# Altium schematic sheet SDEC944-xD_Fil_Pilote_1-2_(commun).SchDoc: Fil Pilote (1/2)
size 393 x 270 mm; CompanyName: Seccom; Address1: 521, rue du capt. François Garbit; Address2: 69440 Mornant; Address3: seccom@seccom.fr; Address4: www.seccom.fr; DocumentNumber: 14; SheetNumber: 14; SheetTotal: 22; PageSetup: Record=PageOptions|CenterHorizontal=True|CenterVertical=True|PrintScale=0.72|XCorrection=1.00|YCorrection=1.00|PrintKind=0|BorderSize=5000000|LeftOffset=0|BottomOffset=0|Orientation=2|PaperLength=1000|PaperWidth=1000|Scale=100|PaperSource=7|PrintQuality=-4|MediaType=1|DitherType=10|PaperKind=A4|PrintScaleMode=1
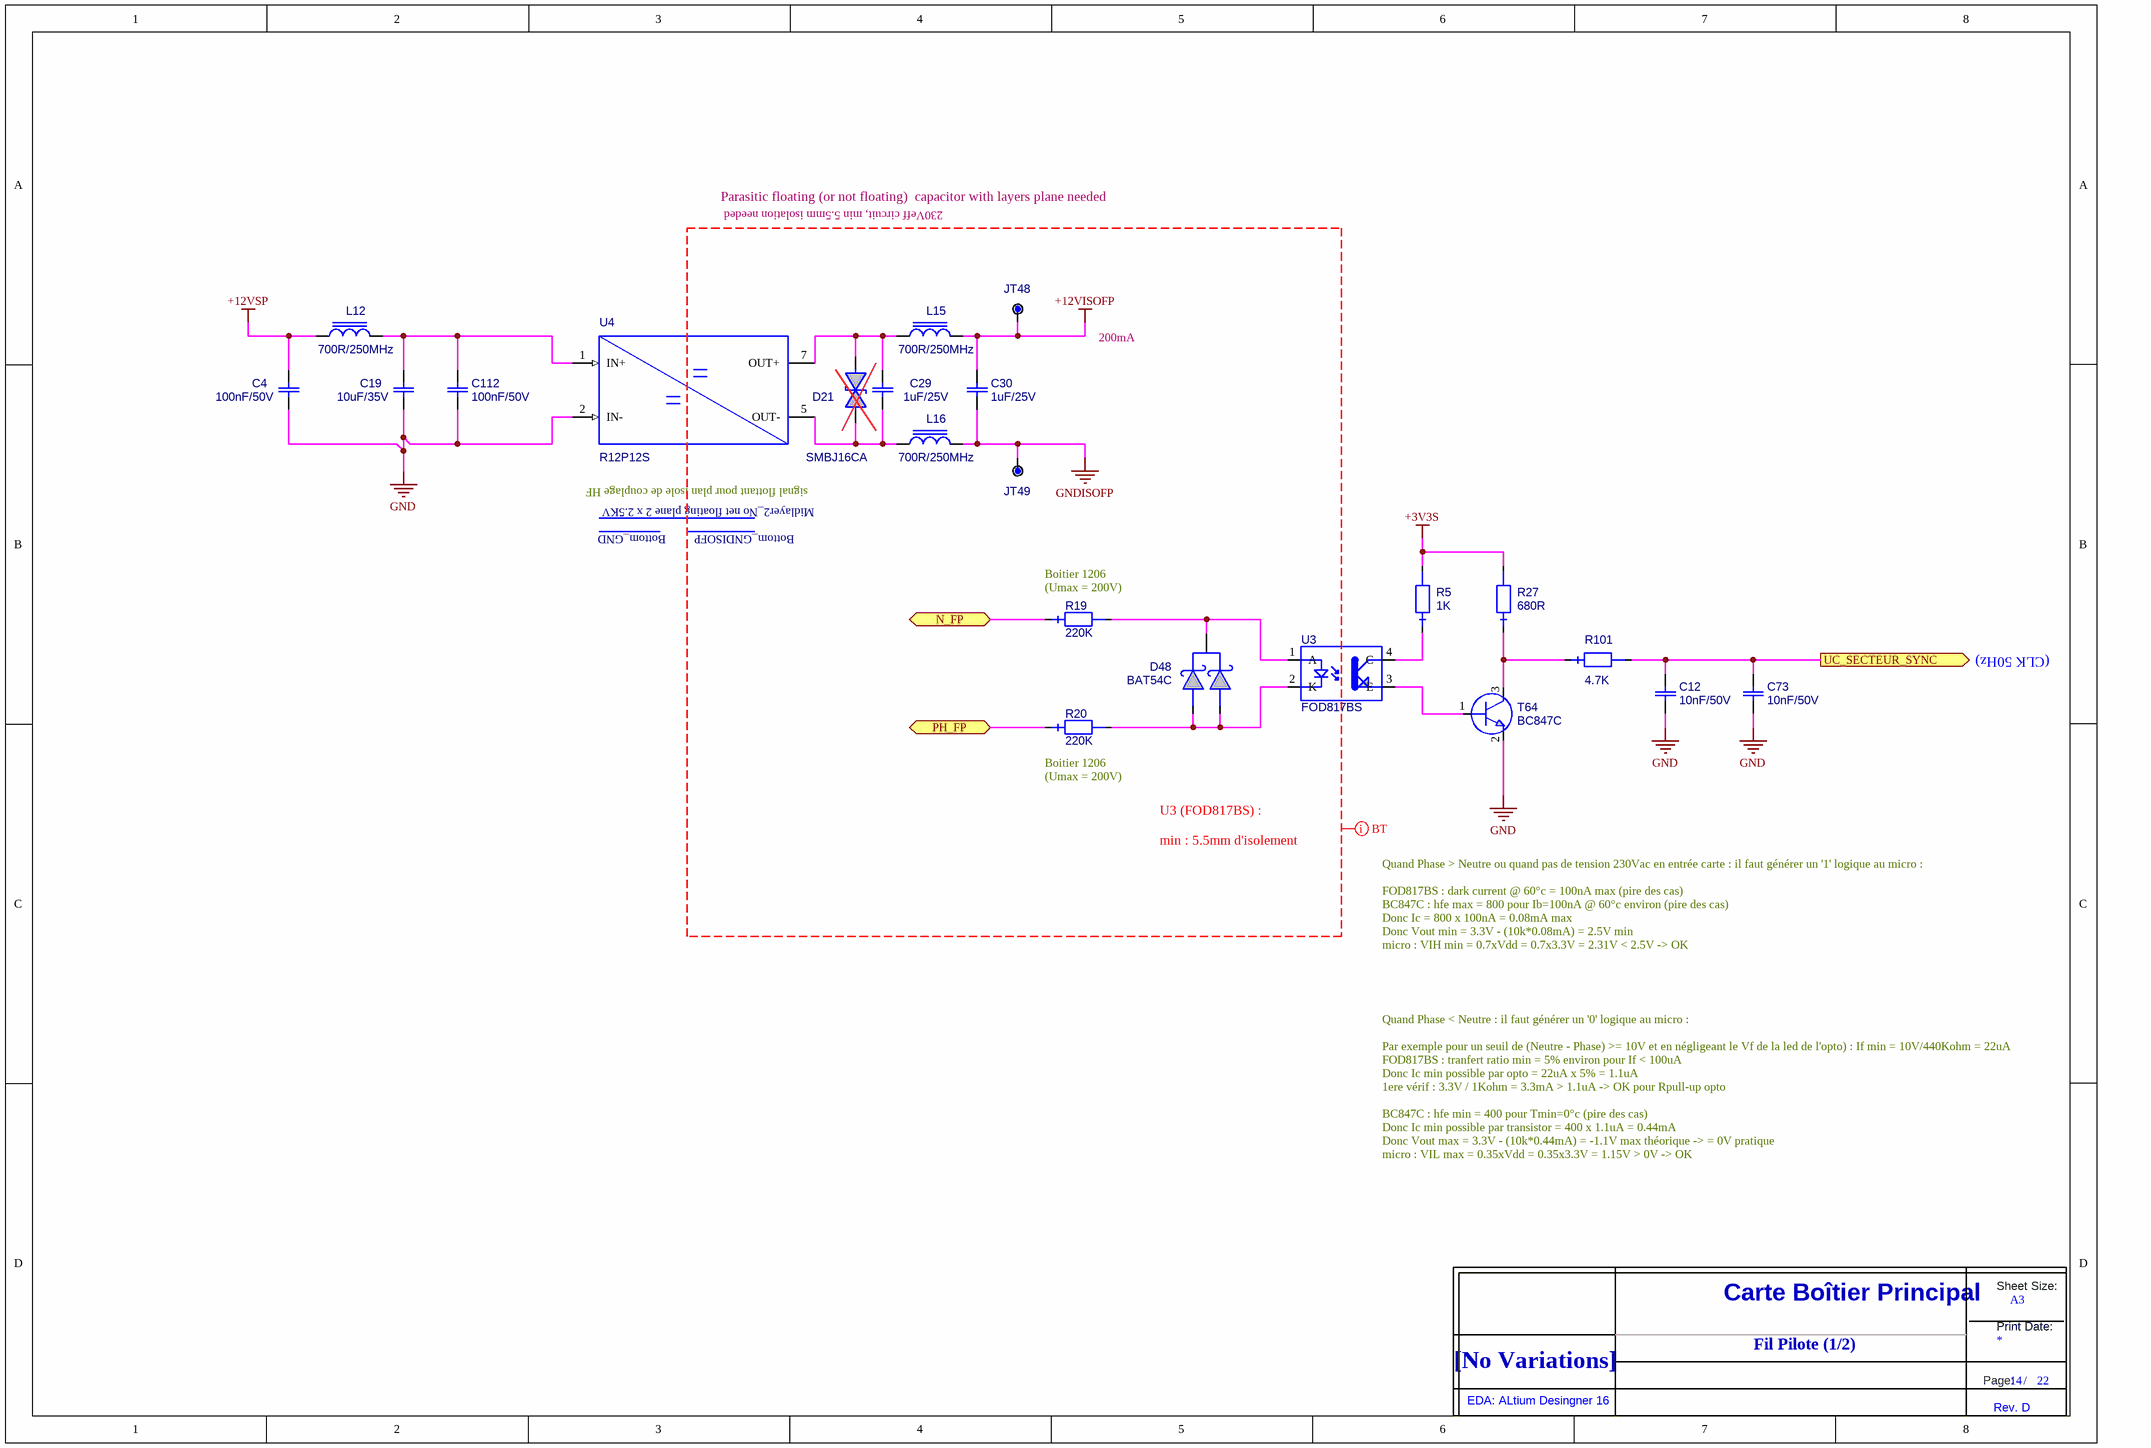
[diagram p0: SDEC944-xD_Fil_Pilote_1-2_(commun).SchDoc]

## Parts
C4  value 100nF/50V  [0603_ReflowSoldering_CAP]  (hidden comment: C_0603_X7R_10%_100N-50V)
C12  value 10nF/50V  [0603_ReflowSoldering_CAP]  (hidden comment: C_0603_X7R_10%_10N-50V)
C19  value 10uF/35V  [1210_ReflowSoldering_CAP]  (hidden comment: C_1210_X5R_10%_10U-35V)
C29  value 1uF/25V  [0805_ReflowSoldering_CAP]  (hidden comment: C_0805_X5R_10%_1U-25V)
C30  value 1uF/25V  [0805_ReflowSoldering_CAP]  (hidden comment: C_0805_X5R_10%_1U-25V)
C73  value 10nF/50V  [0603_ReflowSoldering_CAP]  (hidden comment: C_0603_X7R_10%_10N-50V)
C112  value 100nF/50V  [0603_ReflowSoldering_CAP]  (hidden comment: C_0603_X7R_10%_100N-50V)
D21  SMBJ16CA  [DO214AA-SMB-NP_ReflowSoldering]  (no BOM)
D48  BAT54C  [SOT23_3L_ReflowSoldering]
JT48  POINT_TEST_PAD_40MIL  [PAD_CL5_E40X40Y17D]  (value not drawn)  (no BOM)
JT49  POINT_TEST_PAD_40MIL  [PAD_CL5_E40X40Y17D]  (value not drawn)  (no BOM)
L12  value 700R/250MHz  [0603_ReflowSoldering_CAP]  (hidden comment: IND_FERRITE_0603_742792643)
L15  value 700R/250MHz  [0603_ReflowSoldering_CAP]  (hidden comment: IND_FERRITE_0603_742792643)
L16  value 700R/250MHz  [0603_ReflowSoldering_CAP]  (hidden comment: IND_FERRITE_0603_742792643)
R5  value 1K  [0603_ReflowSoldering_RES]  (hidden comment: RES_0603_1%_100PPM_1K)
R19  value 220K  [1206_ReflowSoldering_RES]  (hidden comment: RES_1206_1%_100PPM_220K)
R20  value 220K  [1206_ReflowSoldering_RES]  (hidden comment: RES_1206_1%_100PPM_220K)
R27  value 680R  [0603_ReflowSoldering_RES]  (hidden comment: RES_0603_1%_100PPM_680R)
R101  value 4.7K  [0603_ReflowSoldering_RES]  (hidden comment: RES_0603_1%_100PPM_4.7K)
T64  BC847C  [SOT23_3L_ReflowSoldering]
Title_new  DNI  (value not drawn)  (graphical)
U3  value FOD817BS  [OPTO_FOD817BS_ReflowSoldering]  (hidden comment: OPTO_FOD817BS)
U4  value R12P12S  [DCDC_SIP_1W_19.5x9.8_h12.5_R12P12S]  (hidden comment: DCDC_+12V_1W_R12P12S)

## Ports
N_FP, PH_FP, UC_SECTEUR_SYNC (out)

## Nets
+3V3S: R5.2 R27.2
+12VISOFP: C30.2 JT48.1 L15.2
+12VSP: C4.1 L12.1
GND: C4.2 C12.1 C19.1 C73.1 C112.2 T64.2(E) U4.2(IN-)
GNDISOFP: C30.1 JT49.1 L16.2
N_FP: R19.1 ; port N_FP
PH_FP: R20.1 ; port PH_FP
UC_SECTEUR_SYNC: C12.2 C73.2 R101.2 ; port UC_SECTEUR_SYNC
NetC19_2: C19.2 C112.1 L12.2 U4.1(IN+)
NetC29_1: C29.1 D21.2 L16.1 U4.5(OUT-)
NetC29_2: C29.2 D21.1 L15.1 U4.7(OUT+)
NetD48_1: D48.1 D48.2 R20.2 U3.2(K)
NetD48_3: D48.3 R19.2 U3.1(A)
NetR5_1: R5.1 U3.4(C)
NetR27_1: R27.1 R101.1 T64.3(C)
NetT64_1: T64.1(B) U3.3(E)

## Layout directives
net class BT: +12VISOFP, GNDISOFP

## Notes on the sheet
- Parasitic floating (or not floating)  capacitor with layers plane needed
- 230Veff circuit, min 5.5mm isolation needed
- 200mA
- Bottom_GND
- Bottom_GNDISOFP
- signal flottant pour plan isole de couplage HF
- Midlayer2_No net floating plane 2 x 2.5KV
- (near R19) Boitier 1206
  (Umax = 200V)
- (CLK 50Hz)
- (near R20) Boitier 1206
  (Umax = 200V)
- U3 (FOD817BS) :
  min : 5.5mm d'isolement
- Quand Phase > Neutre ou quand pas de tension 230Vac en entrée carte : il faut générer un '1' logique au micro :
  FOD817BS : dark current @ 60°c = 100nA max (pire des cas)
  BC847C : hfe max = 800 pour Ib=100nA @ 60°c environ (pire des cas)
  Donc Ic = 800 x 100nA = 0.08mA max
  Donc Vout min = 3.3V - (10k*0.08mA) = 2.5V min
  micro : VIH min = 0.7xVdd = 0.7x3.3V = 2.31V < 2.5V -> OK
- Quand Phase < Neutre : il faut générer un '0' logique au micro :
  Par exemple pour un seuil de (Neutre - Phase) >= 10V et en négligeant le Vf de la led de l'opto) : If min = 10V/440Kohm = 22uA
  FOD817BS : tranfert ratio min = 5% environ pour If < 100uA
  Donc Ic min possible par opto = 22uA x 5% = 1.1uA
  1ere vérif : 3.3V / 1Kohm = 3.3mA > 1.1uA -> OK pour Rpull-up opto
  BC847C : hfe min = 400 pour Tmin=0°c (pire des cas)
  Donc Ic min possible par transistor = 400 x 1.1uA = 0.44mA
  Donc Vout max = 3.3V - (10k*0.44mA) = -1.1V max théorique -> = 0V pratique
  micro : VIL max = 0.35xVdd = 0.35x3.3V = 1.15V > 0V -> OK
- Fil Pilote (1/2)
- (in symbol Title_new) Sheet Size:; Carte Boîtier Principal; A3; Print Date:; [No Variations]; Page:; /; EDA: ALtium Desingner 16; Rev. D

## Library data of the parts
C4 C112 = C_0603_X7R_10%_100N-50V: Condensateur céramique, X7R, 10%, CMS 0603, 100nF/50V; Creation: FB (29/02/12); Boitier: 0603; Remarque: {Remarque}; Fabricant: Kemet; Ref Fab: C0603C104K5RAC; Coeff: 1; ComponentLink1URL: O:\_Documentation\Datasheets\Kemet\Condos_Ceramic_CMS.pdf; ComponentLink2URL: o:\_Documentation\Datasheets\_BOITIERS\PASSIF_CMS\; Config: *; ComponentLink1Description: Datasheet; ComponentLink2Description: Datasheet Boitier; Supplier 1: Farnell; Supplier Part Number 1: 1288255
C12 C73 = C_0603_X7R_10%_10N-50V: Condensateur céramique, X7R, 10%, CMS 0603; Creation: CHD; Boitier: 0603; Remarque: {Remarque}; Coeff: 1; Fabricant: Kemet; Ref Fab: C0603C103K5RAC; ComponentLink1URL: o:\_Documentation\Datasheets\Kemet\Condos_Ceramic_CMS.pdf; ComponentLink2URL: o:\_Documentation\Datasheets\_BOITIERS\PASSIF_CMS\; Config: *; ComponentLink1Description: Datasheet; ComponentLink2Description: Datasheet Boitier; Supplier 1: Farnell; Supplier Part Number 1: 1414609
C19 = C_1210_X5R_10%_10U-35V: Condensateur céramique, X5R, 10%, CMS 1210; Creation: LJ (09/02/09); Reference: 000265/00; Boitier: 1210; Remarque: {Remarque}; Coeff: 1; Fabricant: Taiyo Yuden; Ref Fab: GMK325BJ106KN-T; Verification: *; ComponentLink1URL: o:\_Documentation\Datasheets\TaiyoYuden\High_Value_Multilayer_Ceramic_Caps.pdf; ComponentLink2URL: o:\_Documentation\Datasheets\_Boitiers\PASSIF_CMS\C_1210_(3,2x2,5)_(Schneider).pdf; Config: *; ComponentLink1Description: Datasheet; ComponentLink2Description: Datasheet Boitier
C29 C30 = C_0805_X5R_10%_1U-25V: Condensateur céramique, X5R, 10%, CMS 0805; Creation: FB (07/03/12); Reference: 001834/00; Boitier: 0805; Remarque: {Remarque}; Coeff: 1; Fabricant: AVX; Ref Fab: 08053D105KAT2A; Verification: *; ComponentLink1URL: O:\_Documentation\Datasheets\AVX\Condensateurs_CMS_Ceramic_X5R.pdf; ComponentLink2URL: o:\_Documentation\Datasheets\_Boitiers\PASSIF_CMS\RC_0805_(2x1,25)_(Schneider).pdf; Config: *; ComponentLink1Description: Datasheet; ComponentLink2Description: Datasheet Boitier; Supplier Part Number 1: 1327695; Supplier Part Number 2: 6983409; Supplier 1: Farnell; Supplier 2: Radiospares
D21 = SMBJ16CA: Diode Transil/TVS bidirectionnelle (CA), 600W, 16V, CMS, serie SMBJ; Creation: FB (30/07/13); Boitier: DO214AA/SMB; Remarque: {Remarque}; Coeff: 1; Fabricant: Bourns; ComponentLink1URL: O:\_Documentation\Datasheets\Bourns\SMBJ_diodes_TVS_600W.pdf; ComponentLink2URL: o:\_Documentation\Datasheets\_BOITIERS\ACTIF_CMS\SMx\SMB_(Schneider).lnk; Config: *; ComponentLink1Description: Datasheet; ComponentLink2Description: Datasheet Boitier; Ref Fab: SMBJ16CA; Supplier Part Number 1: 652-SMBJ16CA; Supplier 1: Mouser; Value: SMBJ16CA
D48 = BAT54C: Diode Schottky double, BAT54 cathode com, Vrrm=30V, If=300mA, Vf=0.4Vmax, CMS; Creation: LJ (14/05/02); Reference: 000597/00; Boitier: SOT23_3L; Remarque: {Remarque}; Coeff: 1; Fabricant: NXP; Verification: LJ (14/05/02); ComponentLink1URL: O:\_Documentation\Datasheets\NXP\BAT54_series.pdf; ComponentLink2URL: o:\_Documentation\Datasheets\_BOITIERS\ACTIF_CMS\SOT\SOT_23_3P_(Schneider).PDF; Config: *; ComponentLink1Description: Datasheet; ComponentLink2Description: Datasheet Boitier; Ref Fab: BAT54C; Supplier 1: Farnell; Supplier Part Number 1: 1081192; Value: BAT54C
JT48 JT49 = POINT_TEST_PAD_40MIL: Point de test sur CI, pad de diamètre 1.016mm (40mils); Creation: FB (04/10/12); Remarque: {Remarque}; Coeff: 1; Value: POINT_TEST; Config: *; ComponentLink1Description: Datasheet; ComponentLink2Description: Datasheet Boitier
L12 L15 L16 = IND_FERRITE_0603_742792643: Inductance à ferrite multicouches CMS, imp=700R@250MHz, +/-25%, Rdc=350mR, I=400mA; Creation: PDP (02/08/12); Boitier: 0603; Coeff: 1; Fabricant: Wurth Elektronik; ComponentLink1URL: o:\_Documentation\Datasheets\Murata\Ferrite_BLM21P.pdf; Config: *; ComponentLink1Description: Datasheet; ComponentLink2Description: Datasheet Boitier; Ref Fab: 742792643; Supplier 1: Farnell; Supplier Part Number 1: 1800349
R5 = RES_0603_1%_100PPM_1K: Résistance, 0.100W, 1%, 100ppm, 75V, 1K; Creation: JPL (05/07/12); Boitier: 0603; Remarque: {Remarque}; Fabricant: Vishay; Ref Fab: CRCW06031K00FKEA; Coeff: 1; Verification: *; ComponentLink1URL: O:\_Documentation\Datasheets\Vishay\Resistances_D-CRCWe3.pdf; ComponentLink2URL: o:\_Documentation\Datasheets\_BOITIERS\PASSIF_CMS\; Config: *; ComponentLink1Description: Datasheet; ComponentLink2Description: Datasheet Boitier; Supplier 1: Farnell; Supplier 2: RadioSpares; Supplier Part Number 1: 1469740; Supplier Part Number 2: 6789875
R19 R20 = RES_1206_1%_100PPM_220K: Résistance, 0.25W, 1%, 100ppm, 200V, 220K; Creation: PDP (29/09/12); Boitier: 1206; Remarque: {Remarque}; Fabricant: Vishay; Ref Fab: CRCW1206220KFKEA; Coeff: 1; Verification: *; ComponentLink1URL: O:\_Documentation\Datasheets\Vishay\Resistances_D-CRCWe3.pdf; ComponentLink2URL: o:\_Documentation\Datasheets\_BOITIERS\PASSIF_CMS\; Config: *; ComponentLink1Description: Datasheet; ComponentLink2Description: Datasheet Boitier; Supplier 1: Mouser; Supplier Part Number 1: 71-CRCW1206-220K-E3; Supplier 2: Farnell; Supplier Part Number 2: 1152834
R27 = RES_0603_1%_100PPM_680R: Résistance, 0.100W, 1%, 100ppm, 75V, 680R; Creation: FB (02/08/12); Boitier: 0603; Remarque: {Remarque}; Fabricant: Vishay; Ref Fab: CRCW0603680RFKEA; Coeff: 1; Verification: *; ComponentLink1URL: O:\_Documentation\Datasheets\Vishay\Resistances_D-CRCWe3.pdf; ComponentLink2URL: o:\_Documentation\Datasheets\_BOITIERS\PASSIF_CMS\; Config: *; ComponentLink1Description: Datasheet; ComponentLink2Description: Datasheet Boitier; Supplier 1: Farnell; Supplier Part Number 1: 1469834; Supplier 2: Mouser; Supplier Part Number 2: 71-CRCW0603-680-E3
R101 = RES_0603_1%_100PPM_4.7K: Résistance, 0.100W, 1%, 100ppm, 75V, 4.7K; Creation: JPL (05/07/12); Boitier: 0603; Remarque: {Remarque}; Fabricant: Vishay; Ref Fab: CRCW06034K70FKEA; Coeff: 1; Verification: *; ComponentLink1URL: O:\_Documentation\Datasheets\Vishay\Resistances_D-CRCWe3.pdf; ComponentLink2URL: o:\_Documentation\Datasheets\_BOITIERS\PASSIF_CMS\; Config: *; ComponentLink1Description: Datasheet; ComponentLink2Description: Datasheet Boitier; Supplier 1: Farnell; Supplier 2: RadioSpares; Supplier Part Number 1: 1469807; Supplier Part Number 2: 6790484
T64 = BC847C: Transistor NPN, Vce=50V, Ic=0.1A, hfe=420~800, 0.25W, CMS; Creation: GO (08/07/05); Verification: LJ (21/07/05); Reference: 000329/00; Boitier: SOT23_3L; Remarque: Complementaires aux BC856-860; Fabricant: NXP; Coeff: 1; Ref Fab: BC847C; ComponentLink1URL: O:\_Documentation\Datasheets\NXP\BC847.pdf; ComponentLink2URL: o:\_Documentation\Datasheets\_BOITIERS\ACTIF_CMS\SOT\SOT_23_3P_(Schneider).PDF; Config: *; ComponentLink1Description: Datasheet; Value: BC847C; Supplier 1: Farnell; Supplier Part Number 1: 1081235; ComponentLink2Description: Datasheet Boitier
Title_new = Title_new
U3 = OPTO_FOD817BS: Optocouleur simple, IR GaAs, Viso=5kVrms, If=50mA, Vce=70V, Ic=50mA, CTR=130-260, CMS; Creation: FB (10/07/12); Boitier: MDIP4-SM; Remarque: {Remarque}; Coeff: 1; Fabricant: Fairchild; Verification: *; ComponentLink1URL: O:\_Documentation\Datasheets\Fairchild\FOD814A.pdf; ComponentLink2URL: o:\_Documentation\Datasheets\; Config: *; ComponentLink1Description: Datasheet; ComponentLink2Description: Datasheet Boitier; Ref Fab: FOD817BS; Supplier Part Number 1: 512-FOD817BS; Supplier 1: Mouser
U4 = DCDC_+12V_1W_R12P12S: Convertisseur DC/DC, 1W, Vin=12V, Vout=+12V/84mA, boitier SIP4, isol 6.4kV; Creation: LJ (11/06/12); Boitier: DCDC_SIP_19.5x9.8_h12.5mm; Coeff: 1; Fabricant: Recom; Verification: *; ComponentLink1URL: o:\_Documentation\Datasheets\Recom\Convertisseur_DCDC_RxxPxx.pdf; ComponentLink2URL: o:\_Documentation\Datasheets\_BOITIERS\; ComponentLink1Description: Datasheet; ComponentLink2Description: Datasheet Boitier; Ref Fab: R12P12S; Supplier 1: Mouser; Supplier Part Number 1: 919-R12P12S